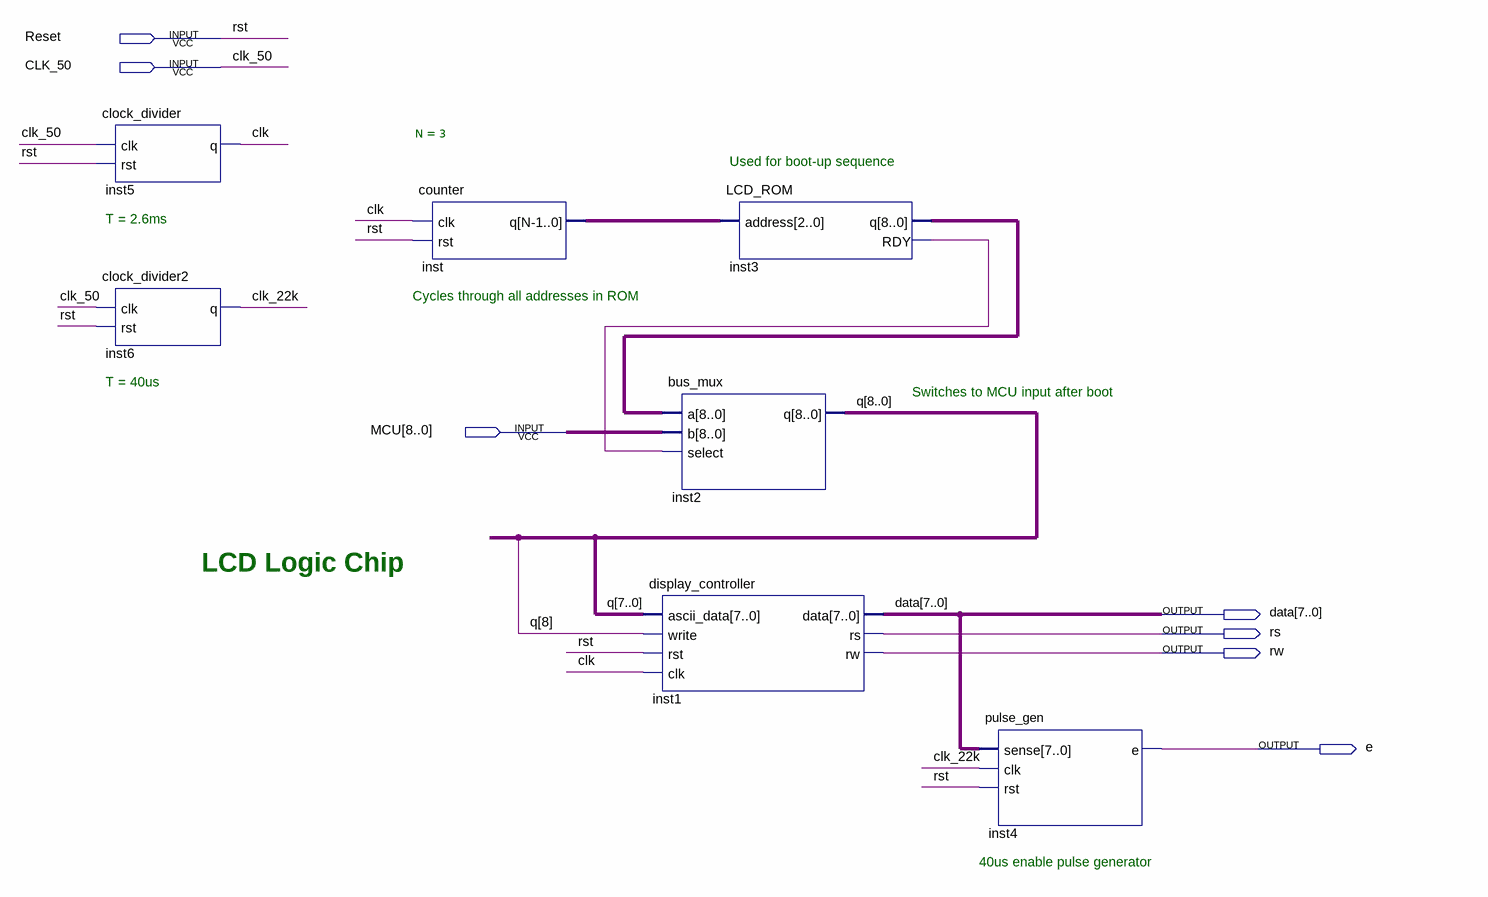
[diagram p0: schematic sheet]
// Quartus schematic LCD_Logic.bdf as structural Verilog: 7 symbols, 7 pins
module LCD_Logic (
  input  Reset,
  input  CLK_50,
  input  [8:0] MCU,
  output [7:0] data,
  output rs,
  output rw,
  output e
);

  wire clk, clk_22k, inst3_rdy;
  wire [2:0] inst_q;
  wire [8:0] inst3_q, q;

  clock_divider inst5 (.clk(CLK_50), .rst(Reset), .q(clk));
  clock_divider2 inst6 (.clk(CLK_50), .rst(Reset), .q(clk_22k));
  counter #(.N(3)) inst (.clk(clk), .rst(Reset), .q(inst_q));
  bus_mux inst2 (.a(inst3_q), .b(MCU), .select(inst3_rdy), .q(q));
  display_controller inst1 (.ascii_data(q[7:0]), .write(q[8]), .rst(Reset), .clk(clk), .data(data), .rs(rs), .rw(rw));
  LCD_ROM inst3 (.address(inst_q), .q(inst3_q), .RDY(inst3_rdy));
  pulse_gen inst4 (.sense(data), .clk(clk_22k), .rst(Reset), .e(e));

  // Other names for the same wires on the sheet: rst = Reset

  // Notes on the sheet:
  //   Used for boot-up sequence
  //   T = 2.6ms
  //   Cycles through all addresses in ROM
  //   T = 40us
  //   Switches to MCU input after boot
  //   LCD Logic Chip
  //   40us enable pulse generator
endmodule
